# Altium project SMPS_PCB_Project.PrjPcb
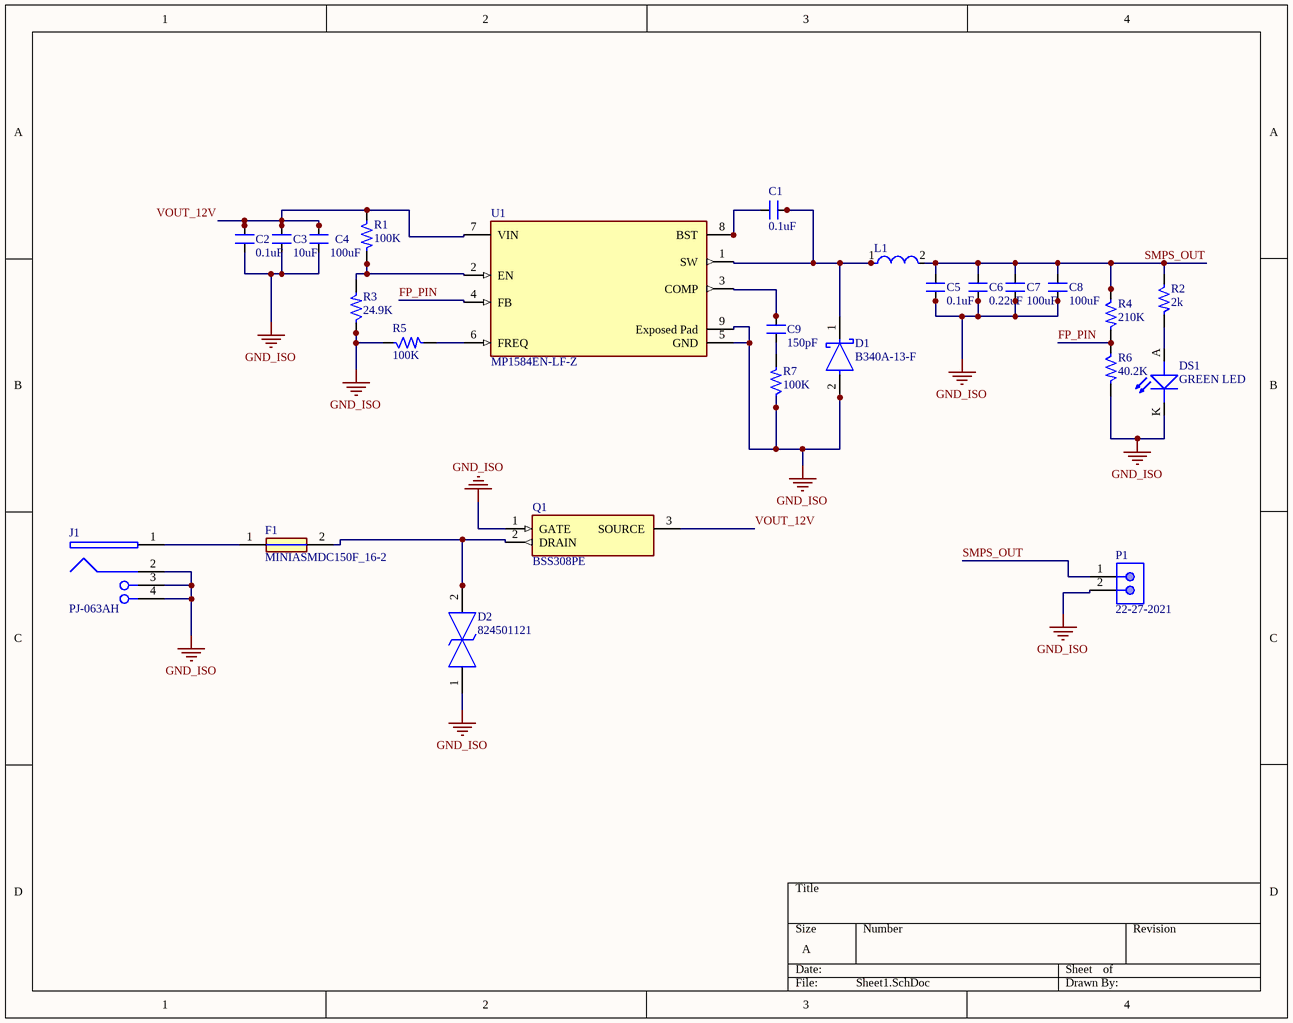
[diagram p0: Sheet1.SchDoc]
1 sheet, 25 parts. Net scope: global (net labels, ports and power ports of the same name join across sheets).
Board file: PCB1.PcbDoc

## Sheet Sheet1.SchDoc
size A; SheetNumber: 1; SheetTotal: 1

### Parts
C1  0.1uF  [CAP_0805]
C2  0.1uF  [CAP_0805]
C3  10uF  [CAP_1206]
C4  100uF  [CAP_1206]
C5  0.1uF  [CAP_0805]
C6  0.22uF  [CAP_0805]
C7  100uF  [CAP_1206]
C8  100uF  [CAP_1206]
C9  150pF  [CAP_0805]
D1  B340A-13-F  [FP-SMA-MFG]
D2  824501121  [DIONM5127X250N]
DS1  GREEN LED  [LED_0805]
F1  MINIASMDC150F_16-2  [FUSC4632X48N]
J1  PJ-063AH  [CUI-PJ-063AH_V]
L1  ETQ-P3M150KVN  [FP-PCC-M0630M-LP-MFG]  (value not drawn)
P1  22-27-2021  [MOLX-22-27-2021_V]
Q1  BSS308PE  [SOT95P260X110-3N]
R1  100K  [RES_0603]
R2  2k  [RES_0603]
R3  24.9K  [RES_0603]
R4  210K  [RES_0603]
R5  100K  [RES_0603]
R6  40.2K  [RES_0603]
R7  100K  [RES_0603]
U1  MP1584EN-LF-Z  [FP-MP1584EN-LF-Z-MFG]

### Nets
GND_ISO: C2.1 C3.1 C4.1 C5.1 C6.1 C7.1 C8.1 D1.2(A) D2.1 DS1.K(CATHODE) J1.2 J1.3(SHLD) J1.4(SHLD) P1.2 Q1.1(GATE) R3.1 R5.1 R6.2 R7.1 U1.5(GND) U1.9(Exposed_Pad)
FP_PIN: R4.2 R6.1 U1.4(FB)
SMPS_OUT: C5.2 C6.2 C7.2 C8.2 L1.2 P1.1 R2.1 R4.1
VOUT_12V: C2.2 C3.2 C4.2 Q1.3(SOURCE) R1.1 U1.7(VIN)
NetC1_1: C1.1 D1.1(C) L1.1 U1.1(SW)
NetC1_2: C1.2 U1.8(BST)
NetC9_1: C9.1 R7.2
NetC9_2: C9.2 U1.3(COMP)
NetD2_2: D2.2 F1.2 Q1.2(DRAIN)
NetDS1_A: DS1.A(ANODE) R2.2
NetF1_1: F1.1 J1.1
NetR1_2: R1.2 R3.2 U1.2(EN)
NetR5_2: R5.2 U1.6(FREQ)

### Library data of the parts
C1 C2 C5 = CAP_0.1uF-50V-20%-0805: 0.1µF ±20% 50V Ceramic Capacitor X7R 0805 (2012 Metric); Manufacturer: Samsung Electro-Mechanics; Manufacturer Part Number: CL21B104MBCNNNC; Alternate Part Number-1: NA; Case/Package: 0805; Supplier-1: SIRICOM; Supplier Part Number-1: 0805B104K500CT
C3 = CAP_10uF-50V-10%-1206: 10µF ±10% 50V Ceramic Capacitor X7R 1206 (3216 Metric); Manufacturer: KEMET; Manufacturer Part Number: CL31B106KBHNNNE; Alternate Part Number-1: GRT31CR61H106ME01L; Case/Package: 1206; Supplier-1: SIRICOM; Supplier Part Number-1: CC1206KKX5R9BB106
C4 C7 C8 = CAP_0.1uF-50V-5%-1206: 100µF ±5% 50V Ceramic Capacitor X7R 1206 (3216 Metric); Manufacturer: KEMET; Manufacturer Part Number: C1206C104J5RACTU; Alternate Part Number-1: NA; Case/Package: 1206; Supplier-1: SIRICOM; Supplier Part Number-1: 1206B104J500CT
C6 = CAP_0.22uF-50V-10%-0805: 0.22µF ±10% 50V Ceramic Capacitor X7R 0805 (2012 Metric); Manufacturer: Murata; Manufacturer Part Number: GRM21BR71H224KA01L; Alternate Part Number-1: 0805F224M500NT; Case/Package: 0805; Supplier-1: SIRICOM; Supplier Part Number-1: 0805B224K500CT
C9 = CAP_150pF-50V-10%-0805: 150pF ±10% 50V Ceramic Capacitor C0G, NP0 0805 (2012 Metric); Manufacturer: AVX Corporation; Manufacturer Part Number: 08055A151KAT2A; Alternate Part Number-1: NA; Case/Package: 0805; Supplier-1: Digikey; Supplier Part Number-1: 478-10501-1-ND - Cut Tape (CT)
D1 = CMP-1667-00003-3: DIODE SCHOTTKY 40V 3A SMA; Max Forward Surge Current (Ifsm): 80A; Forward Voltage: 500mV; Polarity: Standard; Max Reverse Current: 500uA; Capacitance: 250pF; Element Configuration: Single; Mount: Surface Mount; Output Current: 3A; Radiation Hardening: No; Width: 2.92mm; Current Rating: 3A; Termination: SMD/SMT; Voltage: 40V; Series: -; Max Operating Temperature: 125°C; Current: 3A; Max Repetitive Reverse Voltage (Vrrm): 40V; Min Operating Temperature: -55°C; REACH SVHC: No SVHC; Number of Pins: 2; Average Rectified Current: 3A; Contact Plating: Tin; RoHS Compliant: Yes; Max Reverse Voltage (DC): 40V; Packaging: Tape and Reel; Height: 2.3mm; Length: 4.6mm; Case/Package: SMA; Weight: 0.002258oz; Peak Non-Repetitive Surge Current: 80A; Package Quantity: 5000; Lead Free: Lead Free; Forward Current: 3A; Voltage Rating (DC): 40V
D2 = 824501121: TVS Diode (Bi-directional); Manufacturer_Name: Wurth Elektronik; Datasheet Link: http://uk.rs-online.com/web/p/products/9217298P; Height: 2.5mm; Manufacturer_Part_Number: 824501121; Mouser Part Number: 710-824501121; Mouser Price/Stock: https://www.mouser.co.uk/ProductDetail/Wurth-Elektronik/824501121?qs=16w8nSHsg3tpLWkpbtDAQg%3D%3D
DS1 = LED_GREEN-2.2-20mA-0805: Green 569nm LED Indication - Discrete 2.1V 0805 (2012 Metric); Manufacturer: Vishay Lite-On; Manufacturer Part Number: LTST-C171GKT; Alternate Part Number-1: NA; Case/Package: 0805; Supplier-1: SP ROAD; Supplier Part Number-1: LTST-C171GKT
F1 = MINIASMDC150F_16-2: Fuse; Manufacturer_Name: LITTELFUSE; Manufacturer_Part_Number: MINIASMDC150F/16-2; Datasheet Link: https://componentsearchengine.com/Datasheets/1/MINIASMDC150F_16-2.pdf; Height: 0.48mm; Mouser Part Number: 650-MINIASMDC150F/16; Mouser Price/Stock: https://www.mouser.com/Search/Refine.aspx?Keyword=650-MINIASMDC150F%2F16; Arrow Part Number: MINIASMDC150F/16-2; Arrow Price/Stock: https://www.arrow.com/en/products/miniasmdc150f16-2/littelfuse
J1 = CMP-2000-06898-1: Through Hole Right Angle DC Power Jack, 8 A, 2 mm Center Pin, 2 Position, -25 to 85 degC, RoHS, Bulk; Manufacturer: CUIInc.; Voltage Rating: 24V; Current Rating: 8A; Inside Contact Diameter: 2mm; Insulation Resistance: 100MOhms; Outside Contact Diameter: 6.5mm; Brand: CUI; Termination Style: ThroughHole; Flammability Rating: UL94V-0; Datasheet Version: Rev. 1.02, 03/2016; Manufacturer URL: http://www.cui.com/; Product Category: DCPowerConnectors; Package Description: 2-Pin Through Hole Device, Body 13 x 10 mm, Height 9 mm; Connector Type: DCPowerJack; Factory Pack Quantity: 500; Contact Plating: Nickel; Mounting Style: KinkedPin; Contact Material: Copper; RoHS: True; Mounting Angle: Right; Package Reference: PJ-063AH; Product: Jacks; Contact Gender: Male; Datasheet URL: http://www.cui.com/product/resource/pj-063ah.pdf; Housing Material: PolybutyleneTerephthalate(PBT); Mounting Technology: ThroughHole; Operating Temperature Range: -25Cto+85C
L1 = CMP-05439-000005-1: FIXED IND 15UH 3A 109.12 MOHM; Manufacturer: Panasonic; Test Frequency: 100kHz; Shielding: true; Series Resistance: 109.12mΩ; Automotive Grade: Grade 0; Tolerance: 20%; Saturation Current: 5.1A; Standoff Height: 0.05mm; Rms Current: 2.5A; Core Material: Metal Composite; Height: 3mm; Category: Ind; Digikey Description: FIXED IND 15UH 3A 109.12 MOHM; Temperature: -55°C to +155°C; Value: 15uH; Device Class L2: Inductors; RoHS: TRUE; Package: PCC-M0630M-LP; Manufacturer Part Number: ETQ-P3M150KVN; Automotive: Yes; Lead Free: Yes; Inductance: 15uH; Temperature Range High: +155°C; ComponentLink2URL: https://industrial.panasonic.com/cdbs/www-data/pdf/AGL0000/AGL0000C63.pdf; Octopart: https://octopart.com/etqp3m150kvn-panasonic-71577976; ComponentLink2Description: Datasheet; Temperature Range Low: -55°C; Device Class L1: Passive Components; Device Class L3: Fixed Inductors
P1 = CMP-2000-05537-1: Male Header, Pitch 2.54 mm, 1 x 2 Position, Height 11.7 mm, Tail Length 3.56 mm, 0 to 75 degC, RoHS, Bulk; Manufacturer: Molex; PartNumber: 0022272021; Current rating: 4A; Package Version: Rev. BC, 02/2012; Voltage rating: 250V; No. of Positions: 2; Pitch: 2.54mm; No. of Rows: 1; Orientation: Vertical; Operating temperature: 0°Cto+75°C; Manufacturer URL: http://www.molex.com/; Mounting Technology: ThroughHole; Housing material: Nylon(UL94V-0); Package Description: 2-Leads Header, Body 5.08 x 5.8 mm, Pitch 2.54 mm; Voltage - Max: 250V; Datasheet URL: http://www.molex.com/pdm_docs/sd/022272021_sd.pdf; Package Reference: 22-27-2021; Contact material: Tinplatedbrass; Current - Max: 4A; Datasheet Version: Rev. F, 06/2009
Q1 = BSS308PE: Transistor; Manufacturer_Name: Infineon; Datasheet Link: http://www.infineon.com/dgdl/Infineon-BSS308PE-DS-v02_03-en.pdf?fileId=db3a304330f686060131099c80400073; Height: 1.1mm; Manufacturer_Part_Number: BSS308PE
R1-R7 = RES_100K-0.1W-1%-0603: 100 kOhms ±1% 0.1W, 1/10W Chip Resistor 0603 (1608 Metric) Automotive AEC-Q200 Thick Film; Manufacturer: Stackpole Electronics; Manufacturer Part Number: RMCF0603FT100K; Alternate Part Number-1: NA; Case/Package: 0603; Supplier-1: Arrow; Supplier Part Number-1: RMCF0603FT100K
U1 = CMP-57379-000006-1: IC REG BUCK ADJ 3A; Manufacturer: Monolithic Power Systems; Output Type: AdjustableProgrammable; Nominal Supply Current: 100uA; Switching Frequency: 100-1500kHz; Max Power Dissipation: 2.5W; Output Voltage: 0.8-25V; Max Junction Temp: +125°C; Min Supply Voltage: 4.5V; Max Supply Voltage: 28V; Number Of Outputs: 1; Standoff Height: 0mm; ComponentLink2URL: https://www.monolithicpower.com/en/documentview/productdocument/index/doc_url/L01QMTU4NF9yMS4wLnBkZg%3D%3D/release_date/MjAwOS0wNC0wOSAwMDowMDowMA%3D%3D/; Lead Free: Yes; Package: MP1584EN-LF-Z; Temperature Range Low: -20°C; Temperature: -20°C to +125°C; Height: 1.7mm; Ambient Temperature Range Low: -20°C; RoHS: TRUE; Automotive: No; Ipc Land Pattern Name: SOIC127P600X150-8; Ambient Temperature Range High: +85°C; Device Class L2: Power Management ICs; ComponentLink2Description: Datasheet; Manufacturer Part Number: MP1584EN-LF-Z; Device Class L3: Voltage Regulators - Switching; Octopart: https://octopart.com/mp1584en-lf-z-monolithic+power+systems-18629680; Category: IC; Output Current: 3A; Digikey Description: IC REG BUCK ADJ 3A; Temperature Range High: +125°C; Device Class L1: Integrated Circuits (ICs); Switching Topology: Buck